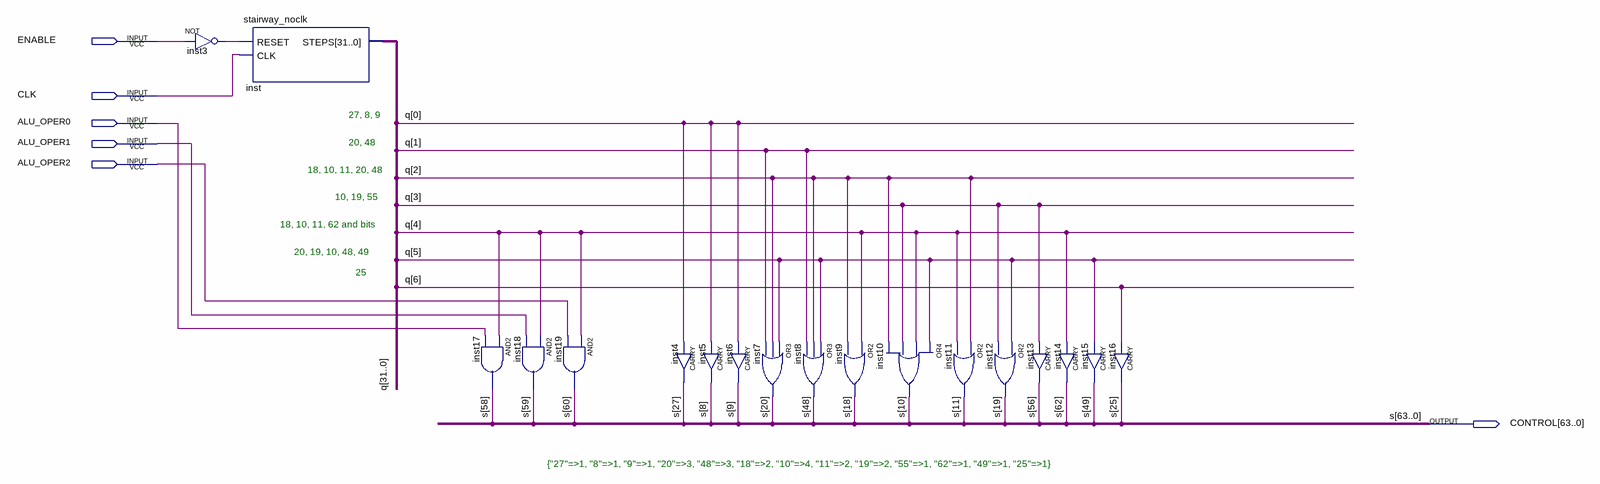
[diagram p0: schematic sheet]
// Quartus schematic macro_alu_1.bdf as structural Verilog: 18 symbols, 6 pins
module macro_alu_1 (
  input  ENABLE,
  input  CLK,
  input  ALU_OPER0,
  input  ALU_OPER1,
  input  ALU_OPER2,
  output [63:0] CONTROL
);

  wire inst3_out;
  wire [31:0] q;

  not inst3 (inst3_out, ENABLE);
  stairway_noclk inst (.RESET(inst3_out), .CLK(CLK), .STEPS(q));
  and inst17 (CONTROL[58], q[4], ALU_OPER0);
  and inst18 (CONTROL[59], q[4], ALU_OPER1);
  and inst19 (CONTROL[60], q[4], ALU_OPER2);
  CARRY inst4 (.IN(q[0]), .OUT(CONTROL[27]));
  CARRY inst5 (.IN(q[0]), .OUT(CONTROL[8]));
  CARRY inst6 (.IN(q[0]), .OUT(CONTROL[9]));
  or inst7 (CONTROL[20], q[5], q[2], q[1]);
  or inst8 (CONTROL[48], q[5], q[2], q[1]);
  or inst9 (CONTROL[18], q[4], q[2]);
  or inst10 (CONTROL[10], q[5], q[4], q[3], q[2]);
  or inst11 (CONTROL[11], q[2], q[4]);
  or inst12 (CONTROL[19], q[5], q[3]);
  CARRY inst13 (.IN(q[3]), .OUT(CONTROL[56]));
  CARRY inst14 (.IN(q[4]), .OUT(CONTROL[62]));
  CARRY inst15 (.IN(q[5]), .OUT(CONTROL[49]));
  CARRY inst16 (.IN(q[6]), .OUT(CONTROL[25]));

  // Other names for the same wires on the sheet: s[63:0] = CONTROL

  // Notes on the sheet:
  //   27, 8, 9
  //   20, 48
  //   18, 10, 11, 20, 48
  //   10, 19, 55
  //   18, 10, 11, 62 and bits
  //   20, 19, 10, 48, 49
  //   25
  //   {"27"=>1, "8"=>1, "9"=>1, "20"=>3, "48"=>3, "18"=>2, "10"=>4, "11"=>2, "19"=>2, "55"=>1, "62"=>1, "49"=>1, "25"=>1}
endmodule
